# Altium schematic sheet MLZ1608M220WT0001_MLZ1608M220WT000.schdoc
size 127 x 99 mm
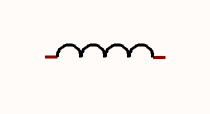
[diagram p0: MLZ1608M220WT0001_MLZ1608M220WT000.schdoc]

## Parts
L?  22uH  [L0603]  (value not drawn)

## Nets

Not connected (* = marked no-connect by the designer): L? 1 2

## Library data of the parts
L? = MLZ1608M220WT000: Manufacturer: TDK; Add into BOM: yes; Tolerance: ±20%; Saturation Current (Isat): 55mA; DC Resistance (DCR): 2.4Ω; Symbol: MLZ1608M220WT000; Device: MLZ1608M220WT000; LCSC Part Name: 22uH ±20% 55mA; Supplier Part: C383393; Manufacturer Part: MLZ1608M220WT000; Supplier Footprint: 0603; JLCPCB Part Class: Extended Part; Datasheet: https://atta.szlcsc.com/upload/public/pdf/source/20160918/1474166926388.pdf; Supplier: LCSC; Convert to PCB: yes; Value: 22uH; Rated Current: -; Q @ Freq: -; Frequency - Self Resonant: -; Ratings: -